# EAGLE design mp3playerLabor_v1 (EAGLE 9.5.1)
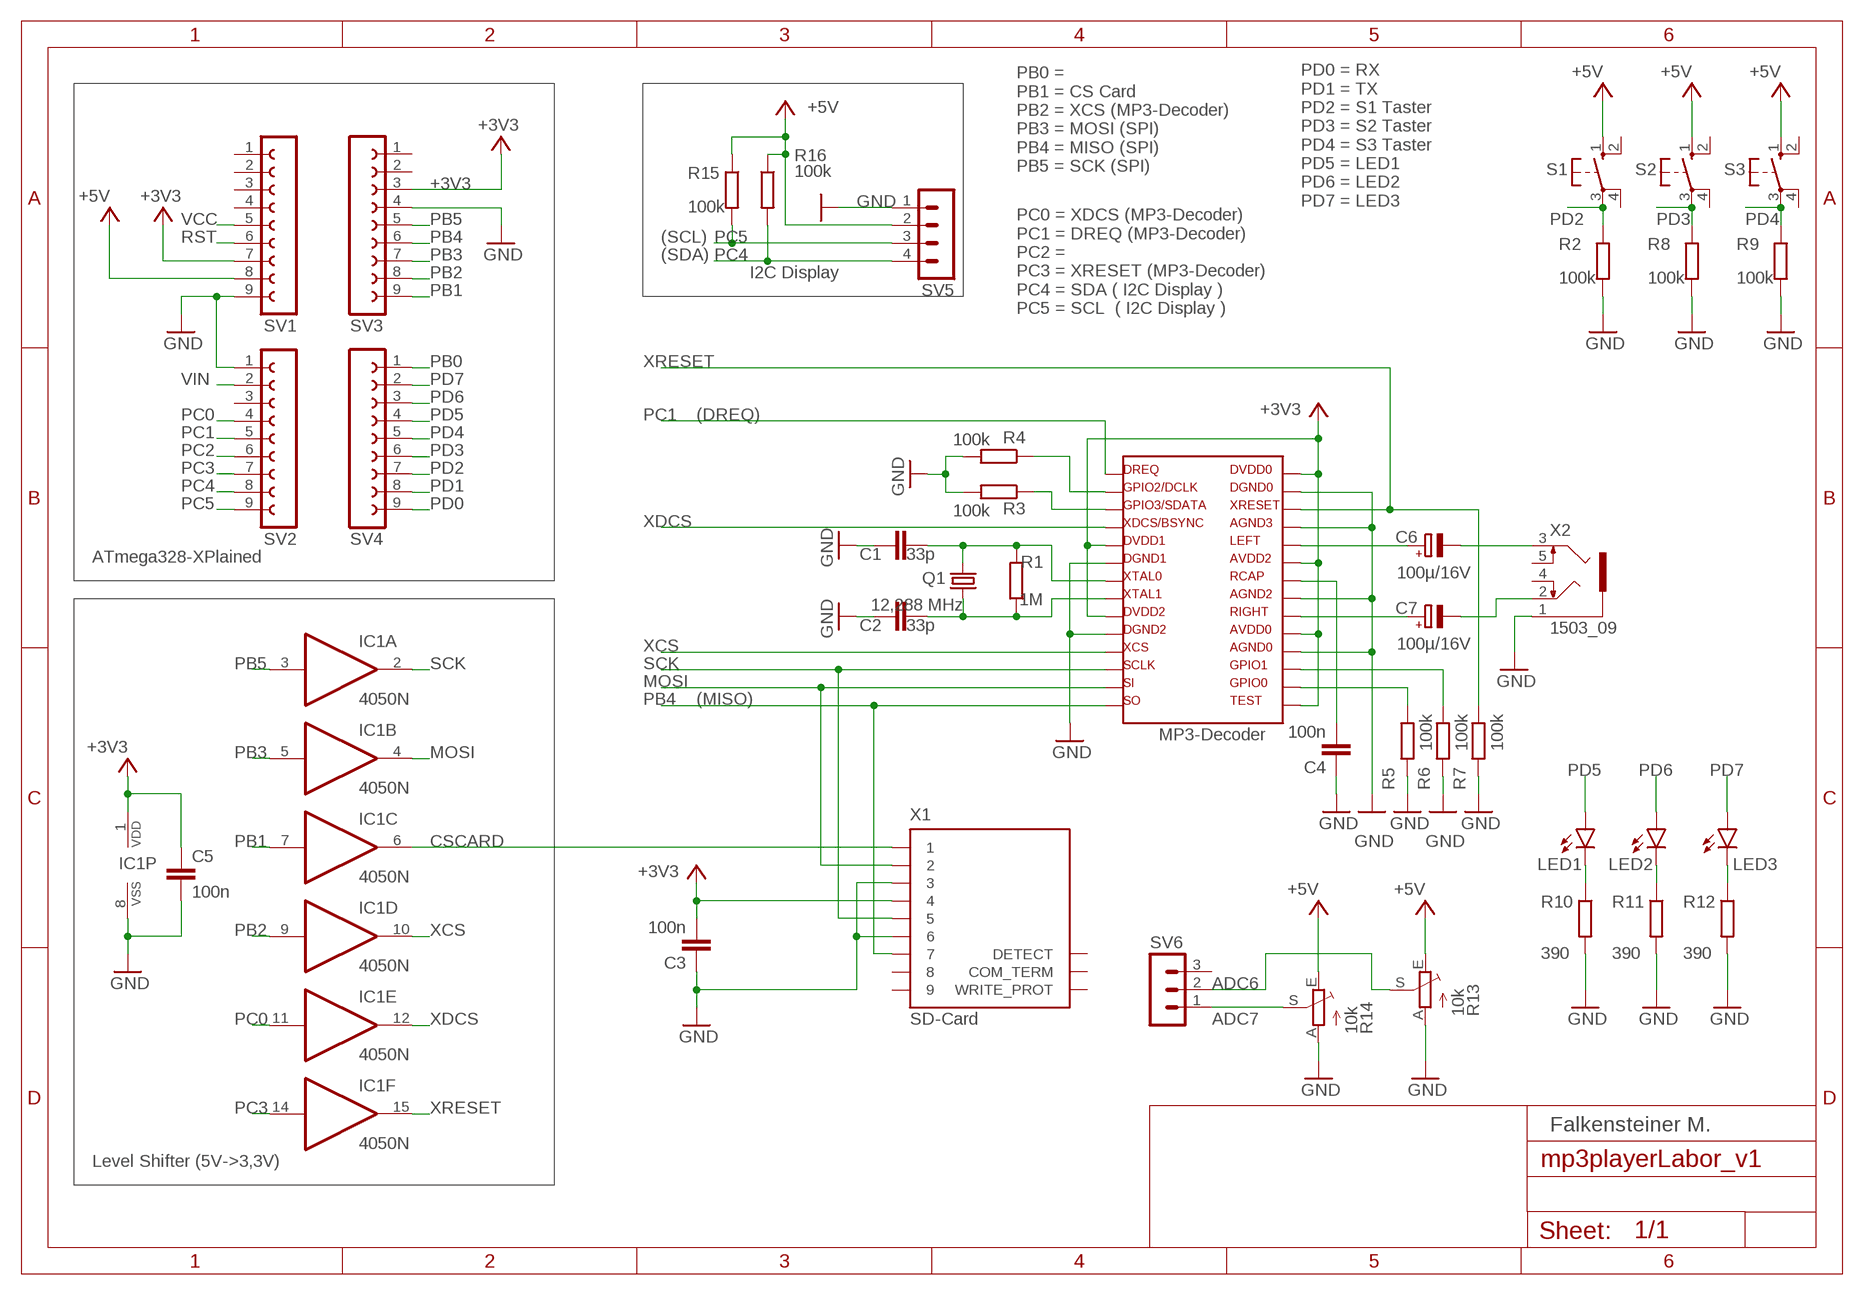
[diagram p0: schematic, sheet 1]

## Parts
C1  33p  C-EUC1206K  [C1206K]
C2  33p  C-EUC1206K  [C1206K]
C3  100n  C-EUC1206K  [C1206K]
C4  100n  C-EUC1206K  [C1206K]
C5  100n  C-EUC1206K  [C1206K]
C6  100µ/16V  CPOL-EUUD-6,3X7,7  [UD-6,3X7,7_NICHICON]
C7  100µ/16V  CPOL-EUUD-6,3X7,7  [UD-6,3X7,7_NICHICON]
IC1  4050N  [DIL16]
LED1  LEDSML1206  [SML1206]
LED2  LEDSML1206  [SML1206]
LED3  LEDSML1206  [SML1206]
Q1  12,288 MHz  CRYSTALHC49UP  [HC49UP]
R1  1M  R-EU_R1206  [R1206]
R2  100k  R-EU_R1206  [R1206]
R3  100k  R-EU_R1206  [R1206]
R4  100k  R-EU_R1206  [R1206]
R5  100k  R-EU_R1206  [R1206]
R6  100k  R-EU_R1206  [R1206]
R7  100k  R-EU_R1206  [R1206]
R8  100k  R-EU_R1206  [R1206]
R9  100k  R-EU_R1206  [R1206]
R10  390  R-EU_R1206  [R1206]
R11  390  R-EU_R1206  [R1206]
R12  390  R-EU_R1206  [R1206]
R13  10k  TRIM_EU-CA6V  [CA6V]
R14  10k  TRIM_EU-CA6V  [CA6V]
R15  100k  R-EU_R1206  [R1206]
R16  100k  R-EU_R1206  [R1206]
S1  10-XX  [B3F-10XX]
S2  10-XX  [B3F-10XX]
S3  10-XX  [B3F-10XX]
SV1  FE09-1  [FE09]
SV2  FE09-1  [FE09]
SV3  FE09-1  [FE09]
SV4  FE09-1  [FE09]
SV5  MA04-1  [MA04-1]
SV6  MA03-1  [MA03-1]
U$1  VS1011  [SOIC-28]
X1  SD-Card  FPS009-3000  [FPS009-3000]
X2  1503_09  [1503_09]

## Nets
+3V3: C3.2 C5.1 IC1.1(P:VDD) SV1.7 SV3.3 U$1.5 U$1.9 U$1.15 U$1.19 U$1.23 U$1.28 X1.4
+5V: R13.E R14.E R15.1 R16.1 S1.1(S) S2.1(S) S3.1(S) SV1.8 SV5.2
ADC6: R13.S SV6.2
ADC7: R14.S SV6.1
CSCARD: IC1.6(C:O) X1.1
GND: C1.1 C2.1 C3.1 C4.1 C5.2 IC1.8(P:VSS) R2.2 R3.2 R4.2 R5.2 R6.2 R7.2 R8.2 R9.2 R10.2 R11.2 R12.2 R13.A R14.A SV1.9 SV2.1 SV3.4 SV5.1 U$1.6 U$1.10 U$1.18 U$1.21 U$1.25 U$1.27 X1.3 X1.6 X2.1
MOSI: IC1.4(B:O) U$1.13 X1.2
N$4: LED1.C R10.1
N$5: LED2.C R11.1
N$6: C2.2 Q1.1 R1.1 U$1.8
N$7: LED3.C R12.1
N$8: C4.2 U$1.22
N$9: R3.1 U$1.3
N$10: C1.2 Q1.2 R1.2 U$1.7
N$11: R4.1 U$1.2
N$13: R6.1 U$1.17
N$14: R5.1 U$1.16
N$19: C7.+ U$1.20
N$20: C6.+ U$1.24
N$22: C6.- X2.3
N$23: C7.- X2.2
PB0: SV4.1
PB1: IC1.7(C:I) SV3.9
PB2: IC1.9(D:I) SV3.8
PB3: IC1.5(B:I) SV3.7
PB4: SV3.6 U$1.14 X1.7
PB5: IC1.3(A:I) SV3.5
PC0: IC1.11(E:I) SV2.4
PC1: SV2.5 U$1.1
PC2: SV2.6
PC3: IC1.14(F:I) SV2.7
PC4: R16.2 SV2.8 SV5.4
PC5: R15.2 SV2.9 SV5.3
PD0: SV4.9
PD1: SV4.8
PD2: R2.1 S1.3(P) SV4.7
PD3: R8.1 S2.3(P) SV4.6
PD4: R9.1 S3.3(P) SV4.5
PD5: LED1.A SV4.4
PD6: LED2.A SV4.3
PD7: LED3.A SV4.2
RST: SV1.6
SCK: IC1.2(A:O) U$1.12 X1.5
VCC: SV1.5
VIN: SV2.2
XCS: IC1.10(D:O) U$1.11
XDCS: IC1.12(E:O) U$1.4
XRESET: IC1.15(F:O) R7.1 U$1.26
Unconnected: S1.2(S1) S1.4(P1) S2.2(S1) S2.4(P1) S3.2(S1) S3.4(P1) SV1.1 SV1.2 SV1.3 SV1.4 SV2.3 SV3.1 SV3.2 SV6.3 X1.8 X1.9 X1.COM_TERM X1.DETECT X1.WRITE_PROT X2.4 X2.5

## Notes on the sheet
- PB0 = 
  PB1 = CS Card
  PB2 = XCS (MP3-Decoder)
  PB3 = MOSI (SPI)
  PB4 = MISO (SPI)
  PB5 = SCK (SPI)
- PD0 = RX
  PD1 = TX
  PD2 = S1 Taster
  PD3 = S2 Taster
  PD4 = S3 Taster
  PD5 = LED1
  PD6 = LED2
  PD7 = LED3
- (SCL)
- (SDA)
- I2C Display
- PC0 = XDCS (MP3-Decoder)
  PC1 = DREQ (MP3-Decoder)
  PC2 =
  PC3 = XRESET (MP3-Decoder)
  PC4 = SDA ( I2C Display )
  PC5 = SCL  ( I2C Display )
- (DREQ)
- ATmega328-XPlained
- (MISO)
- MP3-Decoder
- Falkensteiner M.
- Level Shifter (5V->3,3V)

## Library data of the parts
C1-C5 = rcl:C-EU: CAPACITOR, European symbol
C6 C7 = rcl:CPOL-EU: POLARIZED CAPACITOR, European symbol
IC1 = 40xx:4050: Hex non-inverting BUFFER
LED1-LED3 = led:LED: LED OSRAM: - CHIPLED LG R971, LG N971, LY N971, LG Q971, LY Q971, LO R971, LY R971 LH N974, LH R974 LS Q976, LO Q976, LY Q976 LO Q996 - Hyper CHIPLED LW Q18S LB Q993, LB Q99A, LB R99A - SideLED LS A670, LO A670, LY A670, LG A670, LP A670 LB A673, LV A673, LT A673, LW A673 LH A674 LY A675 LS A676, LA A676, LO A676, LY A676, LW A676 LS A679, LY A679, LG A679 - Hyper Micro SIDELED® LS Y876, LA Y876, LO Y876, LY Y876 LT Y87S - SmartLED LW L88C, LW L88S LB L89C, LB L89S, LG L890 LS L89K, LO L89K, LY L89K LS L896, LA L896, LO L896, LY L896 - TOPLED LS T670, LO T670, LY T670, LG T670, LP T670 LSG T670, LSP T670, LSY T670, LOP T670, LYG T670 LG T671, LOG T671, LSG T671 LB T673, LV T673, LT T673, LW T673 LH T674 LS T676, LA T676, LO T676, LY T676, LB T676, LH T676, LSB T676, LW T676 LB T67C, LV T67C, LT T67C, LS T67K, LO T67K, LY T67K, LW E67C LS E67B, LA E67B, LO E67B, LY E67B, LB E67C, LV E67C, LT E67C LW T67C LS T679, LY T679, LG T679 LS T770, LO T770, LY T770, LG T770, LP T770 LB T773, LV T773, LT T773, LW T773 LH T774 LS E675, LA E675, LY E675, LS T675 LS T776, LA T776, LO T776, LY T776, LB T776 LHGB T686 LT T68C, LB T68C - Hyper Mini TOPLED® LB M676 - Mini TOPLED Santana® LG M470 LS M47K, LO M47K, LY M47K Source: http://www.osram.convergy.de LUXEON: - LUMILED® LXK2-PW12-R00, LXK2-PW12-S00, LXK2-PW14-U00, LXK2-PW14-V00 LXK2-PM12-R00, LXK2-PM12-S00, LXK2-PM14-U00 LXK2-PE12-Q00, LXK2-PE12-R00, LXK2-PE12-S00, LXK2-PE14-T00, LXK2-PE14-U00 LXK2-PB12-K00, LXK2-PB12-L00, LXK2-PB12-M00, LXK2-PB14-N00, LXK2-PB14-P00, LXK2-PB14-Q00 LXK2-PR12-L00, LXK2-PR12-M00, LXK2-PR14-Q00, LXK2-PR14-R00 LXK2-PD12-Q00, LXK2-PD12-R00, LXK2-PD12-S00 LXK2-PH12-R00, LXK2-PH12-S00 LXK2-PL12-P00, LXK2-PL12-Q00, LXK2-PL12-R00 Source: www.luxeon.com KINGBRIGHT: KA-3528ASYC Source: www.kingbright.com
Q1 = crystal:CRYSTAL: CRYSTAL
R1-R12 R15 R16 = rcl:R-EU_: RESISTOR, European symbol; SPICEPREFIX: R
R13 R14 = pot:TRIM_EU-: POTENTIOMETER
S1-S3 = switch-omron:10-XX: OMRON SWITCH
SV1-SV4 = con-lsta:FE09-1: FEMALE HEADER; OC_FARNELL: unknown; OC_NEWARK: unknown
SV5 = con-lstb:MA04-1: PIN HEADER; OC_FARNELL: unknown; OC_NEWARK: unknown
SV6 = con-lstb:MA03-1: PIN HEADER; OC_FARNELL: unknown; OC_NEWARK: unknown
U$1 = vs10xx:VS1011
X1 = con-yamaichi:FPS009-300*: SD Card and MMC Reader (Manual Insertion) Source: http://www.yamaichi.de/pdf/c_fps009_3000.pdf
X2 = con-lumberg:1503_09: Jack connectors according to JISC 6560, 3.5 mm Klinkeneinbaukupplung nach JISC 6560, 3,5 mm, 3-polig/ stereo, abgewinkelte Ausführung, mit 2 Öffnern und Lötaugen, für Leiterplatten Rückseitenmontage Source: http://www.lumberg.com/Produkte/PDFs/1503_09.pdf

## Board
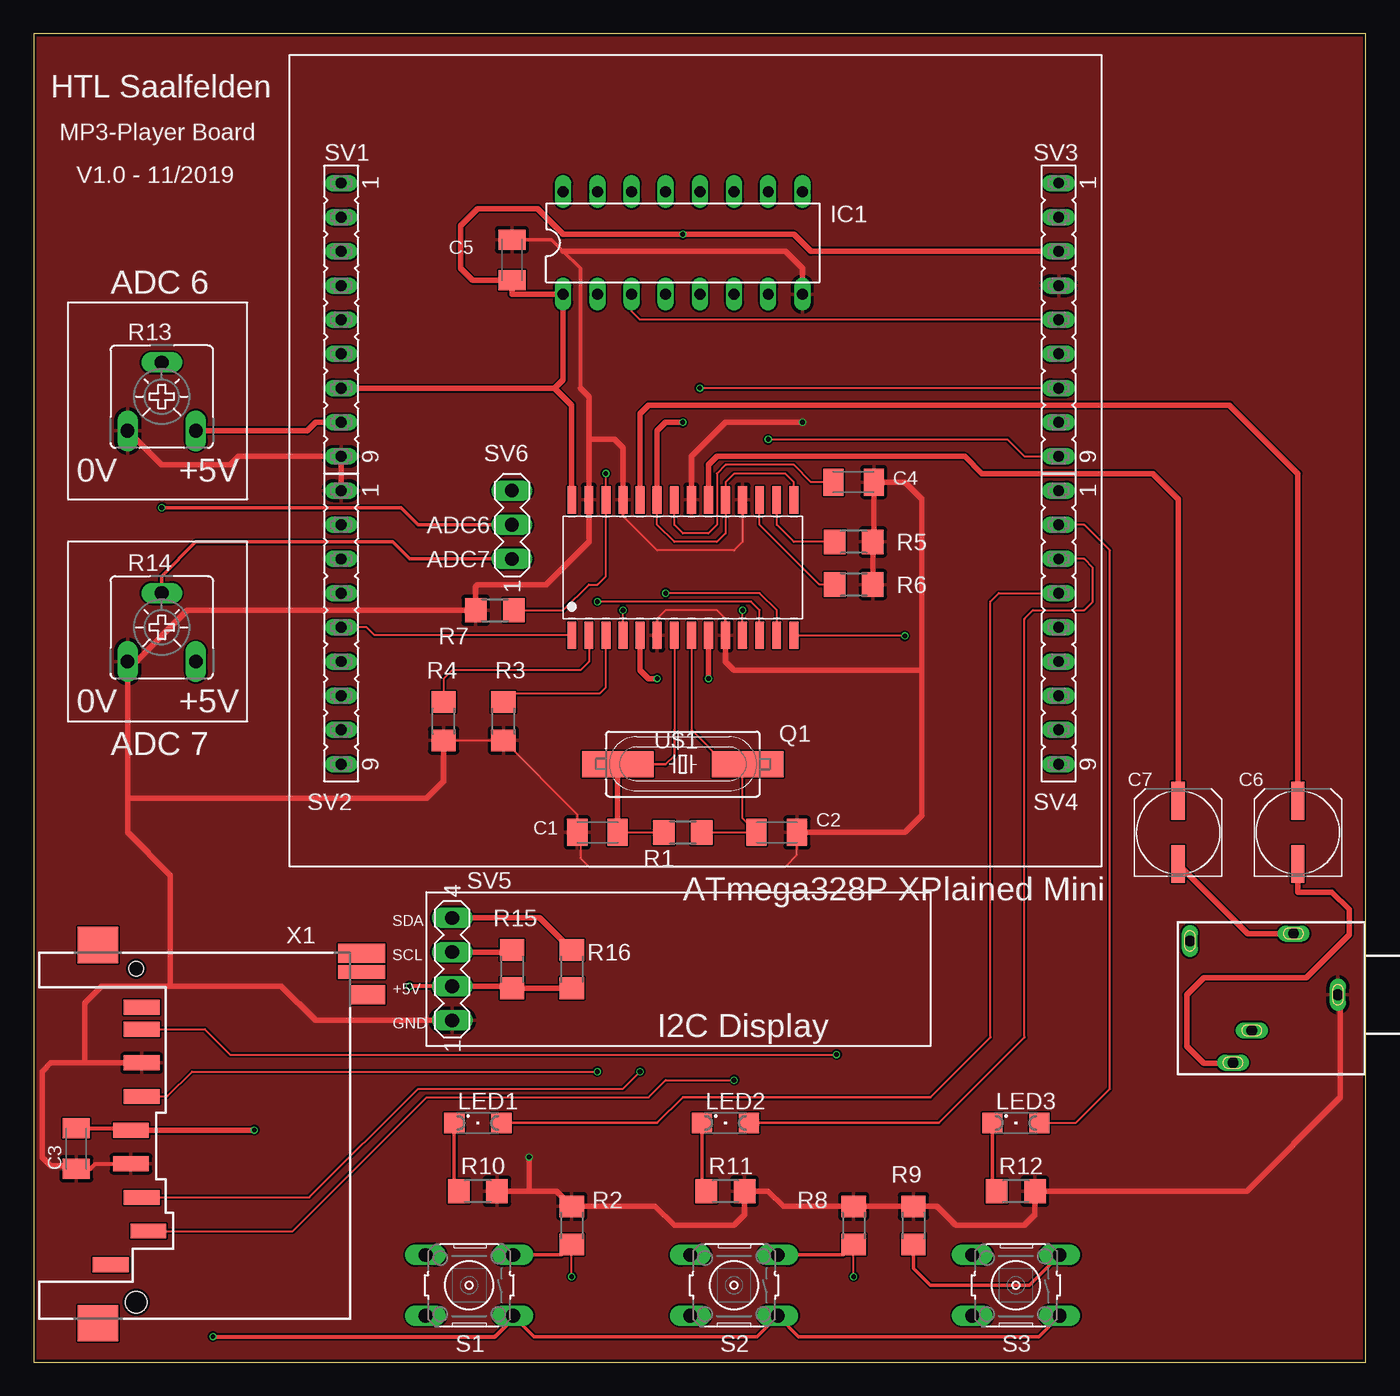
[diagram p1: board, top side]
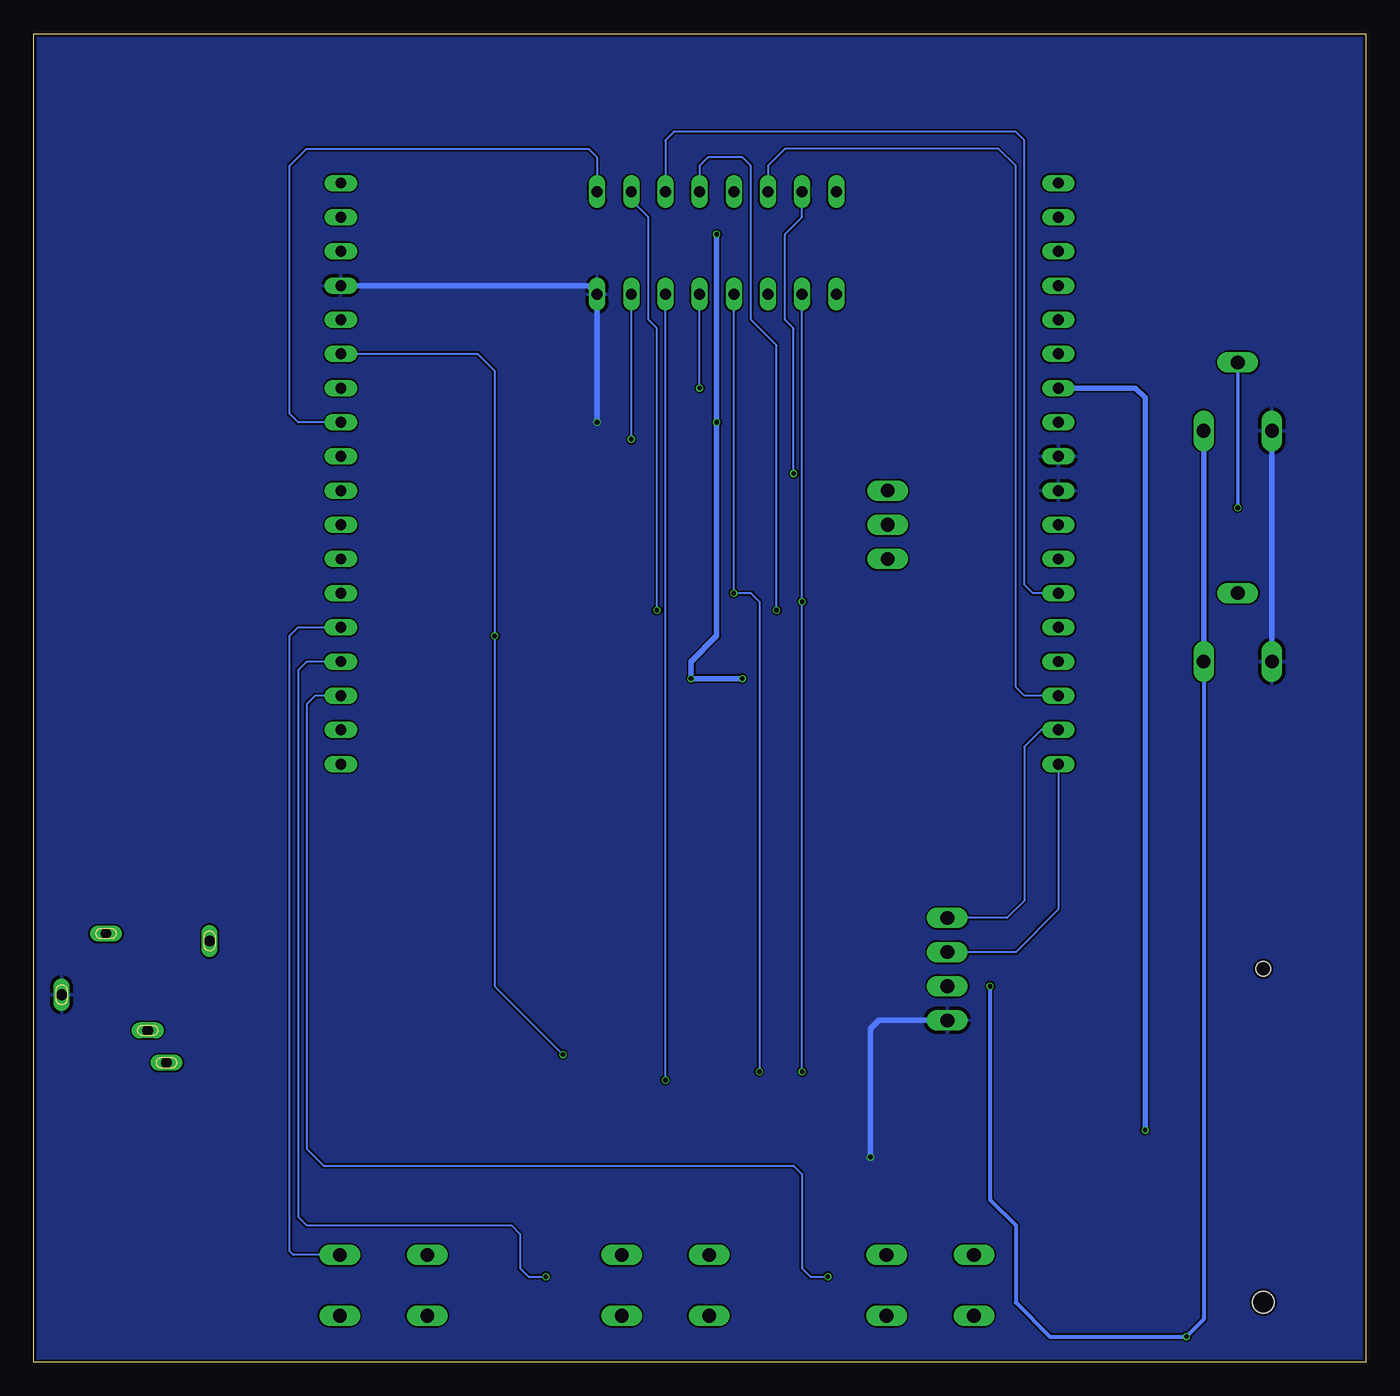
[diagram p2: board, bottom side, seen from below]

Size 99.04 x 98.73 mm. Coordinates in mm from the lower left corner, seen from the top.
Outline: 0,0 99.04,0 99.04,98.73 0,98.73 0,0
Copper layers (1*16): Top 0.035559375mm / dielectric 1.6mm / Bottom 0.035559375mm
Design rules "jlcpcb2layer": minimum track width 5mil, minimum drill 12mil, track to track 5mil, track to pad 5mil, pad to pad 5mil, via to via 5mil, smd to smd 5mil, copper to edge 8mil, drill to drill 6mil, minimum pad ring 5mil, minimum via ring 3mil, stop-mask expansion 2.5mil, vias tented up to drill 0mil, thermal gap 10mil

### Footprints (pad centres in the part's own frame; a part is rotated, then mirrored left to right if it is on the bottom)
C1206K = smd 1.5 x 2: 1 -1.5,0; 2 1.5,0
UD-6,3X7,7_NICHICON = smd 2.8 x 1: + 2.35,0; - -2.35,0
DIL16 = drill 0.813 long: 1 -8.89,-3.81; 2 -6.35,-3.81; 3 -3.81,-3.81; 4 -1.27,-3.81; 5 1.27,-3.81; 6 3.81,-3.81; 7 6.35,-3.81; 8 8.89,-3.81; 9 8.89,3.81; 10 6.35,3.81; 11 3.81,3.81; 12 1.27,3.81; 13 -1.27,3.81; 14 -3.81,3.81; 15 -6.35,3.81; 16 -8.89,3.81
SML1206 = smd 1.5 x 1.5: A 1.75,0; C -1.75,0
HC49UP = smd 5.334 x 1.93: 1 -4.826,0; 2 4.826,0
R1206 = smd 1.6 x 1.803: 1 -1.422,0; 2 1.422,0
CA6V = drill 1.016 long: A -2.54,-2.54; E 2.54,-2.54; S 0,2.54
B3F-10XX = drill 1.016 long: 1 -3.251,2.261; 2 3.251,2.261; 3 -3.251,-2.261; 4 3.251,-2.261
FE09 = drill 0.813 long: 1 -10.16,0; 2 -7.62,0; 3 -5.08,0; 4 -2.54,0; 5 0,0; 6 2.54,0; 7 5.08,0; 8 7.62,0; 9 10.16,0
MA04-1 = drill 1.016 long: 1 -3.81,0; 2 -1.27,0; 3 1.27,0; 4 3.81,0
MA03-1 = drill 1.016 long: 1 -2.54,0; 2 0,0; 3 2.54,0
SOIC-28 = smd 0.66 x 2.032: 1 -6.985,-5.029; 2 -5.715,-5.029; 3 -4.445,-5.029; 4 -3.175,-5.029; 5 -1.905,-5.029; 6 -0.635,-5.029; 7 0.635,-5.029; 8 1.905,-5.029; 9 3.175,-5.029; 10 4.445,-5.029; 11 5.715,-5.029; 12 6.985,-5.029; 13 8.255,-5.029; 14 9.525,-5.029; 15 9.525,5.029; 16 8.255,5.029; 17 6.985,5.029; 18 5.715,5.029; 19 4.445,5.029; 20 3.175,5.029; 21 1.905,5.029; 22 0.635,5.029; 23 -0.635,5.029; 24 -1.905,5.029; 25 -3.175,5.029; 26 -4.445,5.029; 27 -5.715,5.029; 28 -6.985,5.029
FPS009-3000 = smd 2.65 x 1.1: 1 -0.915,-5.3; 2 -0.415,-7.8; 3 0.385,-10.3; 4 0.385,-12.8; 5 -0.415,-15.3; 6 -0.415,-17.8; 7 -0.415,-20.3; 8 -0.415,-21.925; 9 1.885,-2.8 | smd 3.5 x 1: COM_TERM -16.75,-24.55 | smd 2.5 x 1.4: DETECT -17.25,-22.85 | smd 3 x 2.7: M1 2.85,1.55; M2 2.85,-26.55 | smd 3.5 x 1.4: WRITE_PROT -16.75,-25.95 | hole 1.6: 0,0 | hole 1.1: 0,-24.8
1503_09 = drill 0.8 pad 1.2 long: 1 0,-2.1; 2 -4.55,-5.4; 3 5.05,-9.9; 4 -4,-13.1; 5 2.65,-8.5

### Placement (x,y rotation side)
C1  41.91,39.37 0 top
C2  55.24,39.37 180 top
C3  3.17,15.88 90 top
C4  60.96,65.41 180 top
C5  35.56,81.92 90 top
C6  93.98,39.37 90 top
C7  85.09,39.37 90 top
IC1  48.26,83.19 0 top
LED1  33.02,17.78 0 top
LED2  51.44,17.78 0 top
LED3  73.03,17.78 0 top
Q1  48.26,44.45 180 top
R1  48.26,39.37 180 top
R2  40.01,10.16 90 top
R3  34.92,47.62 270 top
R4  30.48,47.62 270 top
R5  60.96,60.96 0 top
R6  60.96,57.78 0 top
R7  34.29,55.88 180 top
R8  60.96,10.16 90 top
R9  65.41,10.16 90 top
R10  33.02,12.7 0 top
R11  51.44,12.7 0 top
R12  73.03,12.7 0 top
R13  9.53,71.75 0 top
R14  9.53,54.61 0 top
R15  35.56,29.21 90 top
R16  40.01,29.21 90 top
S1  32.38,5.71 180 top
S2  52.07,5.71 180 top
S3  73.03,5.71 180 top
SV1  22.86,77.47 270 top
SV2  22.86,54.61 270 top
SV3  76.2,77.47 270 top
SV4  76.2,54.61 270 top
SV5  31.11,29.21 90 top
SV6  35.56,62.23 90 top
U$1  46.99,59.05 0 top
X1  7.62,4.45 180 top
X2  99.06,27.3 270 top

### Tracks (layer width: path | path; a pad name or v marks a point on that pad's centre or on a via)
+3V3  (via drill 0.35)
  Top 0.152: U$1.23 46.35,62.23 47.62,60.96 50.8,60.96 51.44,61.59 U$1.19 51.44,65.41 52.07,66.04 55.88,66.04 56.52,65.41 U$1.15
  Top 0.305: C3.2 7.11,17.38 X1.4
  Top 0.406: SV1.7 38.73,72.39 | 38.73,72.39 40.01,71.12 U$1.28 | 38.73,72.39 39.37,73.03 IC1.1 35.56,79.38 C5.1 32.62,80.42 31.75,81.28 31.75,84.45 33.02,85.72 37.47,85.72 39.37,83.82 v48.26,83.82 56.52,83.82 57.78,82.55 SV3.3 | X1.4 v16.41,17.25 | U$1.5 45.09,51.44 45.72,50.8 v46.35,50.8 | v50.16,50.8 U$1.9 | U$1.23 46.35,69.22 46.99,69.85 v48.26,69.85
  Bottom 0.406: v16.41,17.25 16.41,71.66 17.14,72.39 SV1.7 | v48.26,83.82 v48.26,69.85 48.26,53.98 50.16,52.07 v50.16,50.8 v46.35,50.8
+5V  (via drill 0.35)
  Top 0.254: S1.1 35.74,3.35 37.19,1.91 53.77,1.91 S2.1 56.87,1.91 74.73,1.91 S3.1
  Top 0.305: v13.34,1.91 34.29,1.91 35.74,3.35 | SV5.2 v27.94,27.94
  Top 0.406: SV5.2 35.41,27.94 R15.1 R16.1 | SV1.8 20.95,69.85 20.32,69.22 R13.E
  Bottom 0.305: R14.E 12.06,3.17 v13.34,1.91 23.5,1.91 26.04,4.45 26.04,10.16 27.94,12.06 v27.94,27.94
  Bottom 0.406: R13.E R14.E
ADC6  (via drill 0.35)
  Top 0.254: v9.53,63.5 27.3,63.5 28.57,62.23 SV6.2
  Bottom 0.254: R13.S v9.53,63.5
ADC7
  Top 0.254: R14.S 9.53,58.42 12.06,60.96 26.67,60.96 27.94,59.69 SV6.1
CSCARD  (via drill 0.35)
  Top 0.152: X1.1 19.27,9.74 29.21,19.68 45.72,19.68 46.99,20.95 v52.07,20.95
  Bottom 0.152: v52.07,20.95 IC1.6
GND  (via drill 0.35)
  Top 0.152: R4.2 R3.2 40.41,40.72 C1.1 40.64,39.14 40.64,37.47 41.27,36.83 55.88,36.83 56.74,37.7 C2.1 | U$1.18 52.7,60.96 52.07,60.33 46.35,60.33 43.81,62.87 U$1.25 | U$1.10 51.44,55.24 50.8,55.88 46.99,55.88 46.35,55.24 U$1.6
  Top 0.254: C5.2 38.51,83.42 39.37,82.55 40.64,81.28 40.64,72.39
  Top 0.305: C3.1 4.21,14.38 4.58,14.74 X1.3
  Top 0.406: R13.A 9.53,66.67 14.61,66.67 15.24,67.31 SV1.9 SV2.1 | R10.2 36.83,12.7 | 36.83,12.7 38.89,12.7 R2.2 46.2,11.58 47.62,10.16 52.07,10.16 52.86,10.95 R11.2 54.61,12.7 55.73,11.58 R8.2 R9.2 67.16,11.58 68.58,10.16 73.66,10.16 74.45,10.95 R12.2 90.17,12.7 97.16,19.68 97.16,27.11 X2.1 | 41.27,68.58 U$1.27 41.27,60.96 38.1,57.78 33.02,57.78 32.87,57.63 R7.2 11.43,55.88 7.62,52.07 R14.A 6.99,41.91 | 41.27,68.58 41.27,71.75 40.64,72.39 | C3.1 2.94,14.61 1.27,14.61 0.64,15.24 0.64,21.59 1.29,22.25 3.81,22.25 | 3.81,22.25 X1.6 | R6.2 R5.2 62.46,61.04 C4.1 64.77,65.41 66.04,64.14 66.04,51.44 | v36.83,15.24 36.83,12.7 | SV5.1 20.95,25.4 18.41,27.94 10.16,27.94 | 10.16,27.94 5.08,27.94 3.81,26.67 3.81,22.25 | 10.16,27.94 10.16,36.2 6.99,39.37 6.99,41.91 | IC1.8 57.15,81.28 55.88,82.55 39.37,82.55 | 66.04,51.44 66.04,40.64 64.77,39.37 C2.1 | U$1.10 51.44,52.07 52.07,51.44 66.04,51.44 | R4.2 30.48,43.18 29.21,41.91 6.99,41.91 | U$1.21 48.9,67.31 51.44,69.85 v57.15,69.85 | U$1.25 43.81,67.94 43.18,68.58 41.27,68.58
  Bottom 0.406: R14.A R13.A | v36.83,15.24 36.83,24.77 36.2,25.4 SV5.1 | v57.15,69.85 IC1.8 57.78,80.01 SV3.4
  pour Top: 0,0 99.06,0 99.06,98.42 0,98.42
  pour Bottom: 0,0 99.06,0 99.06,98.42 0,98.42
MOSI  (via drill 0.35)
  Top 0.152: U$1.13 55.24,55.88 53.98,57.15 v46.99,57.15 | X1.2 20.5,12.24 28.57,20.32 43.81,20.32 v45.09,21.59
  Bottom 0.152: IC1.4 v46.99,57.15 45.72,57.15 45.09,56.52 v45.09,21.59
N$4
  Top 0.254: LED1.C 31.27,13.03 R10.1
N$5
  Top 0.254: LED2.C 49.69,13.03 R11.1
N$6
  Top 0.152: U$1.8 48.9,46.99 51.44,44.45 52.7,44.45 | 52.7,44.45 Q1.1 | 52.7,44.45 52.7,40.41 C2.2 R1.1
N$7
  Top 0.254: LED3.C 71.28,13.03 R12.1
N$8
  Top 0.152: C4.2 57.78,65.41 56.52,66.67 51.44,66.67 50.8,66.04 50.8,62.23 50.16,61.59 48.26,61.59 47.62,62.23 U$1.22
N$9
  Top 0.152: R3.1 35.56,49.68 42.06,49.68 42.55,50.16 U$1.3
N$10
  Top 0.152: U$1.7 47.62,46.99 | C1.2 R1.2
  Top 0.2: 47.62,46.99 47.62,45.09 46.97,44.43 43.41,44.43
  Top 0.406: C1.2 43.41,44.43 Q1.2
N$11
  Top 0.152: U$1.2 41.27,52.07 40.64,51.44 31.11,51.44 30.48,50.8 R4.1
N$13
  Top 0.152: R6.1 58.42,57.78 53.98,62.23 U$1.17
N$14
  Top 0.152: R5.1 56.52,60.96 55.24,62.23 U$1.16
N$19
  Top 0.406: U$1.20 50.16,66.67 50.8,67.31 69.22,67.31 70.48,66.04 83.19,66.04 85.09,64.14 C7.+
N$20
  Top 0.406: U$1.24 45.09,70.48 45.72,71.12 88.9,71.12 93.98,66.04 C6.+
N$22
  Top 0.406: C6.- 93.98,34.92 96.52,34.92 97.79,33.66 97.79,31.75 94.61,28.57 87,28.57 85.72,27.3 85.72,23.5 87,22.23 89.13,22.23 X2.3
N$23
  Top 0.406: C7.- 90.25,31.86 X2.2
PB1  (via drill 0.35)
  Top 0.152: v54.61,68.58 72.39,68.58 73.66,67.31 SV3.9
  Bottom 0.152: v54.61,68.58 IC1.7
PB2
  Bottom 0.152: SV3.8 79.38,69.85 80.01,70.48 80.01,88.9 78.74,90.17 57.78,90.17 57.15,89.53 IC1.9
PB3  (via drill 0.35)
  Top 0.152: SV3.7 v49.53,72.39
  Bottom 0.152: v49.53,72.39 IC1.5
PB4  (via drill 0.35)
  Top 0.152: U$1.14 64.72,54.03 v64.77,53.98 | X1.7 12.72,24.75 14.61,22.86 v59.69,22.86
  Bottom 0.152: v59.69,22.86 64.77,27.94 v64.77,53.98 64.77,73.66 66.04,74.93 SV3.6
PB5
  Top 0.152: SV3.5 45.09,77.47 44.45,78.11 IC1.3
PC0
  Bottom 0.152: SV2.4 24.77,57.15 25.4,57.78 25.4,90.81 26.04,91.44 51.44,91.44 52.07,90.81 IC1.11
PC1
  Top 0.152: U$1.1 25.35,54.03 24.77,54.61 SV2.5
PC3
  Bottom 0.152: IC1.14 44.45,88.9 43.18,90.17 27.3,90.17 26.04,88.9 26.04,50.16 25.4,49.53 SV2.7
PC4
  Top 0.406: R16.2 37.62,33.02 SV5.4
  Bottom 0.152: SV2.8 24.13,46.99 25.4,45.72 25.4,34.29 26.67,33.02 SV5.4
PC5
  Top 0.406: R15.2 35.41,30.48 SV5.3
  Bottom 0.152: SV2.9 22.86,33.66 26.04,30.48 SV5.3
PD2  (via drill 0.35)
  Top 0.152: v40.01,6.35 R2.1
  Top 0.254: S1.3 39.24,7.98 R2.1
  Bottom 0.152: SV4.7 78.11,49.53 78.74,48.9 78.74,15.88 77.47,14.61 42.55,14.61 41.91,13.97 41.91,6.99 41.27,6.35 v40.01,6.35
PD3  (via drill 0.35)
  Top 0.152: v60.96,6.35 R8.1
  Top 0.254: S2.3 60.2,7.98 R8.1
  Bottom 0.152: SV4.6 78.74,52.07 79.38,51.44 79.38,10.79 78.74,10.16 63.5,10.16 62.87,9.53 62.87,6.99 62.23,6.35 v60.96,6.35
PD4
  Top 0.254: R9.1 65.41,6.99 66.67,5.71 74.02,5.71 S3.3
  Bottom 0.152: S3.3 79.73,7.98 80.01,8.26 80.01,53.98 79.38,54.61 SV4.5
PD5
  Top 0.152: 71.12,24.13 71.12,56.52 71.75,57.15 SV4.4
  Top 0.2: LED1.A 46.35,17.78 48.26,19.68 66.67,19.68 71.12,24.13
PD6
  Top 0.152: 73.66,24.13 73.66,55.24 74.3,55.88 78.11,55.88 78.74,56.52 78.74,59.05 78.11,59.69 SV4.3
  Top 0.2: LED2.A 67.31,17.78 73.66,24.13
PD7
  Top 0.152: LED3.A 77.47,17.78 80.01,20.32 80.01,60.33 78.11,62.23 SV4.2
SCK  (via drill 0.35)
  Top 0.152: U$1.12 53.98,55.88 53.34,56.52 v41.91,56.52 | X1.5 9.94,19.75 11.79,21.59 v41.91,21.59
  Bottom 0.152: IC1.2 v41.91,56.52 v41.91,21.59
XCS  (via drill 0.35)
  Top 0.152: U$1.11 v52.7,55.88
  Bottom 0.152: v52.7,55.88 52.7,76.83 53.34,77.47 53.34,85.09 54.61,86.36 IC1.10
XDCS  (via drill 0.35)
  Top 0.152: U$1.4 v43.81,55.88
  Bottom 0.152: v43.81,55.88 43.81,75.56 45.72,77.47 45.72,88.9 46.35,89.53 48.9,89.53 49.53,88.9 IC1.12
XRESET  (via drill 0.35)
  Top 0.152: v42.55,66.04 U$1.26 42.55,58.42 41.91,57.78 41.27,57.78 39.37,55.88 R7.1
  Bottom 0.152: v42.55,66.04 42.55,76.83 43.18,77.47 43.18,83.82 41.91,85.09 IC1.15

### Text on the board
tPlace: ATmega328P XPlained Mini | I2C Display
tNames: HTL Saalfelden | MP3-Player Board | V1.0 - 11/2019 | ADC 6 | 0V | +5V | ADC6 | ADC7 | 0V | +5V | ADC 7 | SDA | SCL | +5V | GND